# EAGLE design MIDILodica Sensor Board (EAGLE 9.7.0)
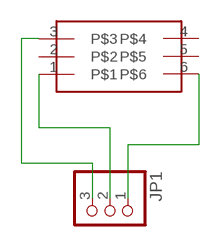
[diagram p0: schematic, sheet 1]

## Parts
JP1  PINHD-1X3  [1X03]
U$3  005PGAA5  [005PGAA5]

## Nets
GND: JP1.2 U$3.1
N$1: JP1.3 U$3.3
VCC: JP1.1 U$3.6
Unconnected: U$3.2 U$3.4 U$3.5

## Library data of the parts
JP1 = adafruit:PINHD-1X3: PIN HEADER
U$3 = Standard:005PGAA5

## Board
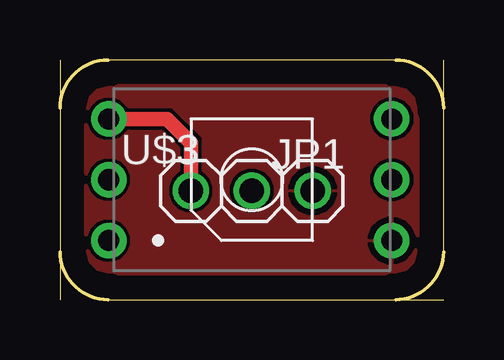
[diagram p1: board, top side]
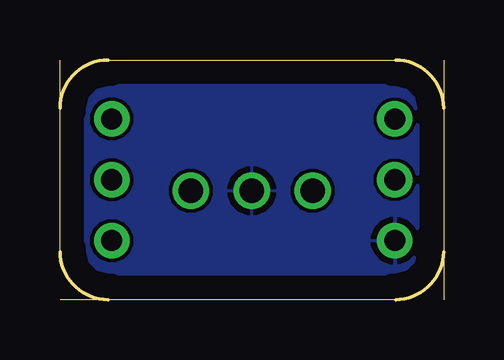
[diagram p2: board, bottom side, seen from below]

Size 16 x 10 mm. Coordinates in mm from the lower left corner, seen from the top.
Outline: 14,0 2,0 arc-90 0,2
Outline: 14,0 16,0
Outline: 16,8 16,2 arc-90 14,0
Outline: 16,8 16,10
Outline: 0,10 0,8
Outline: 0,8 0,2
Outline: 0,2 0,0
Outline: 0,8 arc-90 2,10 14,10 arc-90 16,8
Copper layers (1*16): Top / Bottom
Stack-up Default Layer Stack: Top User Defined 0.035mm / Dielectric-1 User Defined 1.5mm / Bottom User Defined 0.035mm
Design rules "default": minimum track width 6mil, minimum drill 0.35mm, track to track 6mil, track to pad 6mil, pad to pad 6mil, via to via 6mil, smd to smd 6mil, copper to edge 40mil, drill to drill 6mil, minimum pad ring 10mil, minimum via ring 8mil, stop-mask expansion 4mil, vias tented up to drill 0mil, thermal gap 10mil

### Footprints (pad centres in the part's own frame; a part is rotated, then mirrored left to right if it is on the bottom)
1X03 = drill 1.016: 1 -2.54,0; 2 0,0; 3 2.54,0
005PGAA5 = drill 0.877 pad 1.477: 1 -5.967,-2.54; 2 -5.967,0; 3 -5.967,2.54; 4 5.84,2.54; 5 5.84,0; 6 5.84,-2.54

### Placement (x,y rotation side)
JP1  8,4.54 180 top
U$3  8,5 0 top

### Tracks (layer width: path | path; a pad name or v marks a point on that pad's centre or on a via)
GND
  pour Bottom: 0,10 16,10 16,0 0,0
N$1
  Top 0.61: U$3.3 4.46,7.54 5.46,6.54 JP1.3
VCC
  pour Top: 0,10 16,10 16,0 0,0